# Altium schematic sheet Sensor.SchDoc: Sensor
size A4; ApprovedBy: Muhammet YILDIZ; CheckedBy: Muhammet YILDIZ; Author: Muhammet YILDIZ; CompanyName: YıLDıZ IoT; DrawnBy: Muhammet YILDIZ; Engineer: Muhammet YILDIZ; Organization: YıLDıZ IoT; Address1: Elperek Mahallesi; Address2: Saray Sokak No:12; Address3: SAKARYA / TURKEY; Revision: 1; SheetNumber: 6; SheetTotal: 7; SheetSize: A4
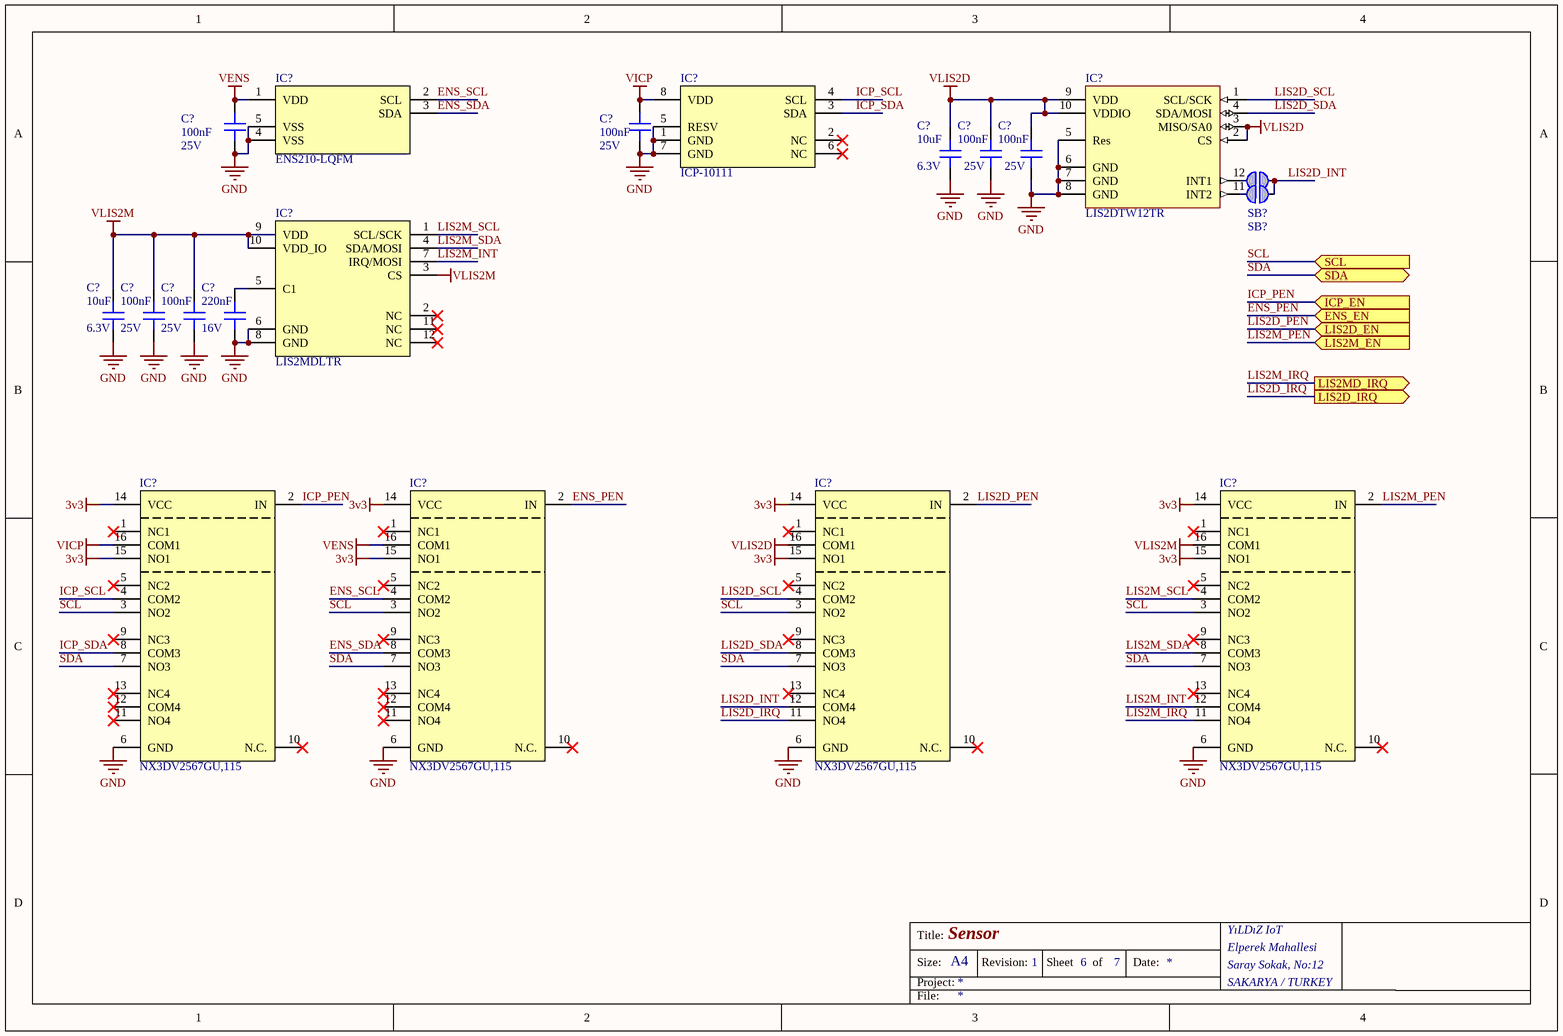
[diagram p0: Sensor.SchDoc]

## Parts
(Parts that share a designator on the sheet are numbered #1, #2 ... from top to bottom, then left to right.)
C?#1  100nF  Voltage Rating (DC): 25V  [CAP 0402/1005]
C?#2  100nF  Voltage Rating (DC): 25V  [CAP 0402/1005]
C?#3  10uF  Voltage Rating: 6.3V  [CAP 0402/1005]
C?#4  100nF  Voltage Rating (DC): 25V  [CAP 0402/1005]
C?#5  100nF  Voltage Rating (DC): 25V  [CAP 0402/1005]
C?#6  10uF  Voltage Rating: 6.3V  [CAP 0402/1005]
C?#7  100nF  Voltage Rating (DC): 25V  [CAP 0402/1005]
C?#8  100nF  Voltage Rating (DC): 25V  [CAP 0402/1005]
C?#9  220nF  Voltage Rating: 16V  [CAP 0402/1005]
IC?#1  ENS210-LQFM  [SCIONSENSE ENS210LQFM]
IC?#2  ICP-10111  [TDK ICP10111]
IC?#3  LIS2DTW12TR  [ST LGA-12 2x2x0.7]
IC?#4  LIS2MDLTR  [ST LGA-12 2x2x0.7]
IC?#5  NX3DV2567GU,115  [NXP XQFN16]
IC?#6  NX3DV2567GU,115  [NXP XQFN16]
IC?#7  NX3DV2567GU,115  [NXP XQFN16]
IC?#8  NX3DV2567GU,115  [NXP XQFN16]
SB?#1  (no value)  [Solderbridge-Circular]  (no BOM)
SB?#2  (no value)  [Solderbridge-Circular]  (no BOM)

## Ports
ENS_EN (in), ICP_EN (in), LIS2D_EN (in), LIS2D_IRQ (out), LIS2M_EN (in), LIS2MD_IRQ (out), SCL (in), SDA (bidir)

## Nets
3v3: IC?#5.14(VCC) IC?#5.15(NO1) IC?#6.14(VCC) IC?#6.15(NO1) IC?#7.14(VCC) IC?#7.15(NO1) IC?#8.14(VCC) IC?#8.15(NO1)
GND: C?#1.1 C?#2.1 C?#3.1 C?#4.1 C?#5.1 C?#6.1 C?#7.1 C?#8.1 C?#9.1 IC?#1.4(VSS) IC?#1.5(VSS) IC?#2.1(GND) IC?#2.5(RESV) IC?#2.7(GND) IC?#3.5(Res) IC?#3.6(GND) IC?#3.7(GND) IC?#3.8(GND) IC?#4.6(GND) IC?#4.8(GND) IC?#5.6(GND) IC?#6.6(GND) IC?#7.6(GND) IC?#8.6(GND)
VENS: C?#1.2 IC?#1.1(VDD) IC?#6.16(COM1)
VICP: C?#2.2 IC?#2.8(VDD) IC?#5.16(COM1)
VLIS2D: C?#3.2 C?#4.2 C?#5.2 IC?#3.2(CS) IC?#3.3(MISO/SA0) IC?#3.9(VDD) IC?#3.10(VDDIO) IC?#7.16(COM1)
VLIS2M: C?#6.2 C?#7.2 C?#8.2 IC?#4.3(CS) IC?#4.9(VDD) IC?#4.10(VDD_IO) IC?#8.16(COM1)
ENS_PEN: IC?#6.2(IN) ; port ENS_EN
ENS_SCL: IC?#1.2(SCL) IC?#6.4(COM2)
ENS_SDA: IC?#1.3(SDA) IC?#6.8(COM3)
ICP_PEN: IC?#5.2(IN) ; port ICP_EN
ICP_SCL: IC?#2.4(SCL) IC?#5.4(COM2)
ICP_SDA: IC?#2.3(SDA) IC?#5.8(COM3)
LIS2D_INT: IC?#7.12(COM4) SB?#1.2 SB?#2.2
LIS2D_IRQ: IC?#7.11(NO4) ; port LIS2D_IRQ
LIS2D_PEN: IC?#7.2(IN) ; port LIS2D_EN
LIS2D_SCL: IC?#3.1(SCL/SCK) IC?#7.4(COM2)
LIS2D_SDA: IC?#3.4(SDA/MOSI) IC?#7.8(COM3)
LIS2M_INT: IC?#4.7(IRQ/MOSI) IC?#8.12(COM4)
LIS2M_IRQ: IC?#8.11(NO4) ; port LIS2MD_IRQ
LIS2M_PEN: IC?#8.2(IN) ; port LIS2M_EN
LIS2M_SCL: IC?#4.1(SCL/SCK) IC?#8.4(COM2)
LIS2M_SDA: IC?#4.4(SDA/MOSI) IC?#8.8(COM3)
SCL: IC?#5.3(NO2) IC?#6.3(NO2) IC?#7.3(NO2) IC?#8.3(NO2) ; port SCL
SDA: IC?#5.7(NO3) IC?#6.7(NO3) IC?#7.7(NO3) IC?#8.7(NO3) ; port SDA
NetC?#9_2: C?#9.2 IC?#4.5(C1)
NetIC?#3_11: IC?#3.11(INT2) SB?#2.1
NetIC?#3_12: IC?#3.12(INT1) SB?#1.1

Not connected (* = marked no-connect by the designer): IC?#2 2(NC)* 6(NC)*; IC?#4 2(NC)* 11(NC)* 12(NC)*; IC?#5 1(NC1)* 5(NC2)* 9(NC3)* 10(N.C.)* 11(NO4)* 12(COM4)* 13(NC4)*; IC?#6 1(NC1)* 5(NC2)* 9(NC3)* 10(N.C.)* 11(NO4)* 12(COM4)* 13(NC4)*; IC?#7 1(NC1)* 5(NC2)* 9(NC3)* 10(N.C.)* 13(NC4)*; IC?#8 1(NC1)* 5(NC2)* 9(NC3)* 10(N.C.)* 13(NC4)*

## Notes on the sheet
- Title:
- Size:
- Project:
- Revision:
- Sheet
- of
- Date:
- YıLDıZ IoT
- Elperek Mahallesi
- Saray Sokak, No:12
- SAKARYA / TURKEY
- File:

## Library data of the parts
C?#1 C?#2 C?#4 C?#5 C?#7 C?#8 = Capacitor - Ceramic: Cap Ceramic 0.1uF 25V X5R 10% Pad SMD 0402 85¡ãC T/R / Multi Layer Ceramic Capacitor (MLCC); Manufacturer: Samsung; Manufacturer Part Number: CL05A104KA5NNNC; Supplier 1: Digi-Key; Supplier Part Number 1: 1276-1043-6-ND; RoHS: Yes; Category: Ceramic Capacitors; Pricing 1: 1=0,10000, 10=0,01100, 50=0,00600, 100=0,00490, 500=0,00346, 1000=0,00272, 2500=0,00248, 5000=0,00228 (USD); Mount: Surface Mount; Case/Package: 0402; Case Code (Imperial): 0402; Case Code (Metric): 1005; Min Operating Temperature: -55°C; Max Operating Temperature: 85°C; Capacitance: 100nF; Packaging: Tape and Reel; Tolerance: 10%; Package Quantity: 1; Voltage Rating: 25V; Dielectric: X5R; Voltage: 25V; Length: 1mm; Width: 0.02inch; Height: 0.5mm; Thickness: 0.022inch; Depth: 0.5mm; Radiation Hardening: No; Lead Free: Lead Free; ComponentLink1URL: https://datasheet.ciiva.com/25802/cl05a104ka5nnnc-25802704.pdf?src-supplier=Digi-Key; ComponentLink1Description: https://datasheet.ciiva.com/25802/cl05a104ka5nnnc-25802704.pdf?src-supplier=Digi-Key; ComponentLink2URL: https://datasheet.ciiva.com/16437/cl05a104ka5nnnc-16437369.pdf?src-supplier=Future+Electronics; ComponentLink2Description: https://datasheet.ciiva.com/16437/cl05a104ka5nnnc-16437369.pdf?src-supplier=Future+Electronics; ComponentLink3URL: https://datasheet.ciiva.com/26838/getdatasheetpartid-357412-26838142.pdf?src-supplier=Verical; ComponentLink3Description: https://datasheet.ciiva.com/26838/getdatasheetpartid-357412-26838142.pdf?src-supplier=Verical; ComponentLink4URL: https://datasheet.ciiva.com/26309/mlcc-catalogdownload2013-eng-26309014.pdf?src-supplier=Distrelec; ComponentLink4Description: https://datasheet.ciiva.com/26309/mlcc-catalogdownload2013-eng-26309014.pdf?src-supplier=Distrelec
C?#3 C?#6 = Capacitor - Ceramic: 0402 10 uF 6.3 V ±20 % Tolerance X5R Surface Mount Multilayer Ceramic Capacitor; Manufacturer: Murata; Manufacturer Part Number: GRM155R60J106ME15D; Tolerance: 20%; Supplier 1: Digi-Key; Supplier Part Number 1: 490-13238-1-ND; RoHS: Yes; Category: Ceramic Capacitors; Pricing 1: 1=0,18000, 10=0,12400, 50=0,07440, 100=0,06280, 500=0,04296, 1000=0,03800, 2500=0,03635, 5000=0,03304 (USD); Mount: Surface Mount; Case/Package: 0402; Case Code (Metric): 1005; Case Code (Imperial): 0402; Min Operating Temperature: -55°C; Max Operating Temperature: 85°C; Packaging: Tape and Reel; Capacitance: 10uF; Voltage Rating (DC): 6.3V; Dielectric: X5R; Length: 0.039inch; Width: 0.02inch; Thickness: 0.026inch; RoHS Compliant: Yes; ComponentLink1URL: https://www.murata.com/~/media/webrenewal/support/library/catalog/products/capacitor/mlcc/c02e.ashx?la=en-us&src-supplier=Digi-Key; ComponentLink1Description: https://www.murata.com/~/media/webrenewal/support/library/catalog/products/capacitor/mlcc/c02e.ashx?la=en-us&src-supplier=Digi-Key
C?#9 = Capacitor - Ceramic: Ceramic capacitor SMD-0402 220nF /16V X7R# K +-10%, Samsung, RoHS; Manufacturer Part Number: CL05B224KO5NNNC; Tolerance: 10%; Dielectric: X7R; Supplier 1: Digi-Key; Supplier Part Number 1: 1276-1176-1-ND; Manufacturer: Samsung; RoHS: Yes; Category: Ceramic Capacitors; Pricing 1: 1=0,10000, 10=0,03300, 50=0,01780, 100=0,01460, 500=0,01040, 1000=0,00817, 2500=0,00742, 5000=0,00683 (USD); Mount: Surface Mount; Case/Package: 0402; Case Code (Metric): 1005; Case Code (Imperial): 0402; Min Operating Temperature: -55°C; Max Operating Temperature: 125°C; Packaging: Tape and Reel; Capacitance: 220nF; Package Quantity: 1; Series: CL; Construction: Flat; Length: 1mm; Width: 0.02inch; Height: 0.5mm; Thickness: 0.022inch; Depth: 0.5mm; Radiation Hardening: No; RoHS Compliant: Yes; ComponentLink1URL: https://datasheet.ciiva.com/25800/cl05b224ko5nnnc-25800450.pdf?src-supplier=Digi-Key; ComponentLink1Description: https://datasheet.ciiva.com/25800/cl05b224ko5nnnc-25800450.pdf?src-supplier=Digi-Key; ComponentLink2URL: https://datasheet.ciiva.com/26838/getdatasheetpartid-358459-26838228.pdf?src-supplier=Verical; ComponentLink2Description: https://datasheet.ciiva.com/26838/getdatasheetpartid-358459-26838228.pdf?src-supplier=Verical; ComponentLink3URL: https://datasheet.ciiva.com/16428/cl05b224ko5nnnc-16428810.pdf?src-supplier=Future+Electronics; ComponentLink3Description: https://datasheet.ciiva.com/16428/cl05b224ko5nnnc-16428810.pdf?src-supplier=Future+Electronics
IC?#1 = SCIOSENSE ENS210-LQFM: ENS210 Series 3.6V 100%RH Relative Humidity & Temperature Sensor w/I²C Interface; Supplier 1: Digi-Key; Supplier Part Number 1: 2618-ENS210-LQFMCT-ND; Manufacturer: ScioSense; Manufacturer Part Number: ENS210-LQFM; Stock 1: 47662; Pricing 1: 1=2,87000, 5=2,66400, 10=2,21400, 25=1,84480, 50=1,64000, 100=1,55800, 500=1,31200, 1000=1,23000 (USD); ComponentLink1URL: https://datasheet.octopart.com/ENS210-LQFM-ScioSense-datasheet-149899868.pdf?src-supplier=Future+Electronics; ComponentLink1Description: https://datasheet.octopart.com/ENS210-LQFM-ScioSense-datasheet-149899868.pdf?src-supplier=Future+Electronics
IC?#2 = TDK ICP-10111: Barometric Pressure/Temperature Sensor Digital 30kPa to 110kPa/-20 to 65°C 8-Pin LGA T/R; Manufacturer: TDK InvenSense; Output Type: I2C; Pressure Type: Differential; Operating Pressure: 15.95PSI; Port Style: No Port; Supplier 1: Digi-Key; Supplier Part Number 1: 1428-1145-1-ND; Manufacturer Part Number: ICP-10111; RoHS: No; Category: Pressure Sensors; Stock 1: 11029; Pricing 1: 1=4,26000, 5=3,76200, 10=3,32300, 25=2,69600, 50=2,38260, 100=2,31990, 500=1,94370, 1000=1,81830, 5000=1,69290 (USD); Case/Package: LGA; Number of Pins: 8; Min Operating Temperature: -40°C; Max Operating Temperature: 85°C; Termination: SMD/SMT; RoHS Compliant: No; ComponentLink1URL: https://product.tdk.com/info/en/documents/catalog_datasheet/capacitive-pressure/DS-000186-ICP-101xx-v1.1.pdf?src-supplier=Digi-Key; ComponentLink1Description: https://product.tdk.com/info/en/documents/catalog_datasheet/capacitive-pressure/DS-000186-ICP-101xx-v1.1.pdf?src-supplier=Digi-Key; ComponentLink2URL: https://product.tdk.com/info/en/documents/catalog_datasheet/capacitive-pressure/DS-000186-ICP-101xx-v1.0.pdf?src-supplier=Digi-Key; ComponentLink2Description: https://product.tdk.com/info/en/documents/catalog_datasheet/capacitive-pressure/DS-000186-ICP-101xx-v1.0.pdf?src-supplier=Digi-Key
IC?#3 = ST LIS2DE12TR: 3-axis MEMS Accelerometer and Temperature Sensor Digital Output 1.8V 12-Pin LGA T/R; Manufacturer: STMicroelectronics; Supplier 1: Digi-Key; Supplier Part Number 1: 497-19047-1-ND; Manufacturer Part Number: LIS2DTW12TR; RoHS: Yes; Category: Accelerometers; Stock 1: 8556; Pricing 1: 1=3,37000, 10=3,02400, 25=2,85880, 100=2,47750, 500=2,11750 (USD)
IC?#4 = ST LIS2MDLTR: LIS2MDL Series 3.6V 50 Hz High Performance 3-Axis Digital Magnetic Sensor-LGA-12; Manufacturer: STMicroelectronics; Output Type: SPI,I2C; Sensing Method: Magnetoresistive; Axis: X, Y, Z; Resolution: 16b; Bandwidth: 50Hz; Supplier 1: Digi-Key; Supplier Part Number 1: 497-17588-1-ND; Manufacturer Part Number: LIS2MDLTR; RoHS: Yes; Category: Inertial Measurement Units (IMUs); Stock 1: 4476; Pricing 1: 1=3,07000, 10=2,75500, 25=2,59880, 100=2,21410, 500=1,81912, 1000=1,73250 (USD); Case/Package: LGA; Number of Pins: 12; Min Operating Temperature: -40°C; Max Operating Temperature: 85°C; Packaging: Tape and Reel; RoHS Compliant: Yes; ComponentLink1URL: http://www.farnell.com/datasheets/2815952.pdf?src-supplier=Farnell; ComponentLink1Description: http://www.farnell.com/datasheets/2815952.pdf?src-supplier=Farnell; ComponentLink2URL: http://www.farnell.com/datasheets/2815952.pdf?src-supplier=Newark; ComponentLink2Description: http://www.farnell.com/datasheets/2815952.pdf?src-supplier=Newark; ComponentLink3URL: http://www.st.com/content/ccc/resource/technical/document/datasheet/group3/29/13/d1/e0/9a/4d/4f/30/DM00395193/files/DM00395193.pdf/jcr:content/translations/en.DM00395193.pdf?src-supplier=Digi-Key; ComponentLink3Description: http://www.st.com/content/ccc/resource/technical/document/datasheet/group3/29/13/d1/e0/9a/4d/4f/30/DM00395193/files/DM00395193.pdf/jcr:content/translations/en.DM00395193.pdf?src-supplier=Digi-Key
IC?#5-IC?#8 = NXP NX3DV2567GU,115: NX3DV2567 Series 4.3 V 10.5 Ohm 4PDT Low-Ohmic Analog Switch - XQFN-16; Manufacturer: NXP Semiconductors; Number of Inputs: 4; Number of Outputs: 2; Number of Channels: 1; Min Supply Voltage: 1.4V; Max Supply Voltage: 4.3V; Max Power Dissipation: 250mW; On-State Resistance: 700mR; Operating Supply Current: 150nA; Turn-On Delay Time: 50ns; Turn-Off Delay Time: 30ns; Supply Type: Single; Supplier 1: Digi-Key; Supplier Part Number 1: 568-5206-1-ND; Manufacturer Part Number: NX3DV2567GU,115; RoHS: Yes; Category: Interface ICs; Stock 1: 5231; Pricing 1: 1=0,98000, 10=0,87300, 25=0,82880, 100=0,80340 (USD); Mount: Surface Mount; Number of Pins: 16; Min Operating Temperature: -40°C; Max Operating Temperature: 125°C; Package Quantity: 1; Packaging: Tape and Reel; Max Supply Current: 150nA; Power Dissipation: 250mW; Series: -; Radiation Hardening: No; Lead Free: Lead Free; RoHS Compliant: Yes; ComponentLink1URL: https://datasheet.ciiva.com/1667/nx3dv2567-1667296.pdf?src-supplier=Digi-Key; ComponentLink1Description: https://datasheet.ciiva.com/1667/nx3dv2567-1667296.pdf?src-supplier=Digi-Key; ComponentLink2URL: https://datasheet.ciiva.com/4917/nx3dv2567-42536-4917579.pdf?src-supplier=Mouser; ComponentLink2Description: https://datasheet.ciiva.com/4917/nx3dv2567-42536-4917579.pdf?src-supplier=Mouser; ComponentLink3URL: https://datasheet.ciiva.com/1667/nx3dv2567-1667295.pdf?src-supplier=Digi-Key; ComponentLink3Description: https://datasheet.ciiva.com/1667/nx3dv2567-1667295.pdf?src-supplier=Digi-Key; ComponentLink4URL: https://datasheet.ciiva.com/1667/nx3dv2567-1667294.pdf?src-supplier=Digi-Key; ComponentLink4Description: https://datasheet.ciiva.com/1667/nx3dv2567-1667294.pdf?src-supplier=Digi-Key; ComponentLink5URL: https://datasheet.ciiva.com/6638/nx3dv2567-6638700.pdf?src-supplier=Digi-Key; ComponentLink5Description: https://datasheet.ciiva.com/6638/nx3dv2567-6638700.pdf?src-supplier=Digi-Key
SB?#1 SB?#2 = SOLDERBRIDGE